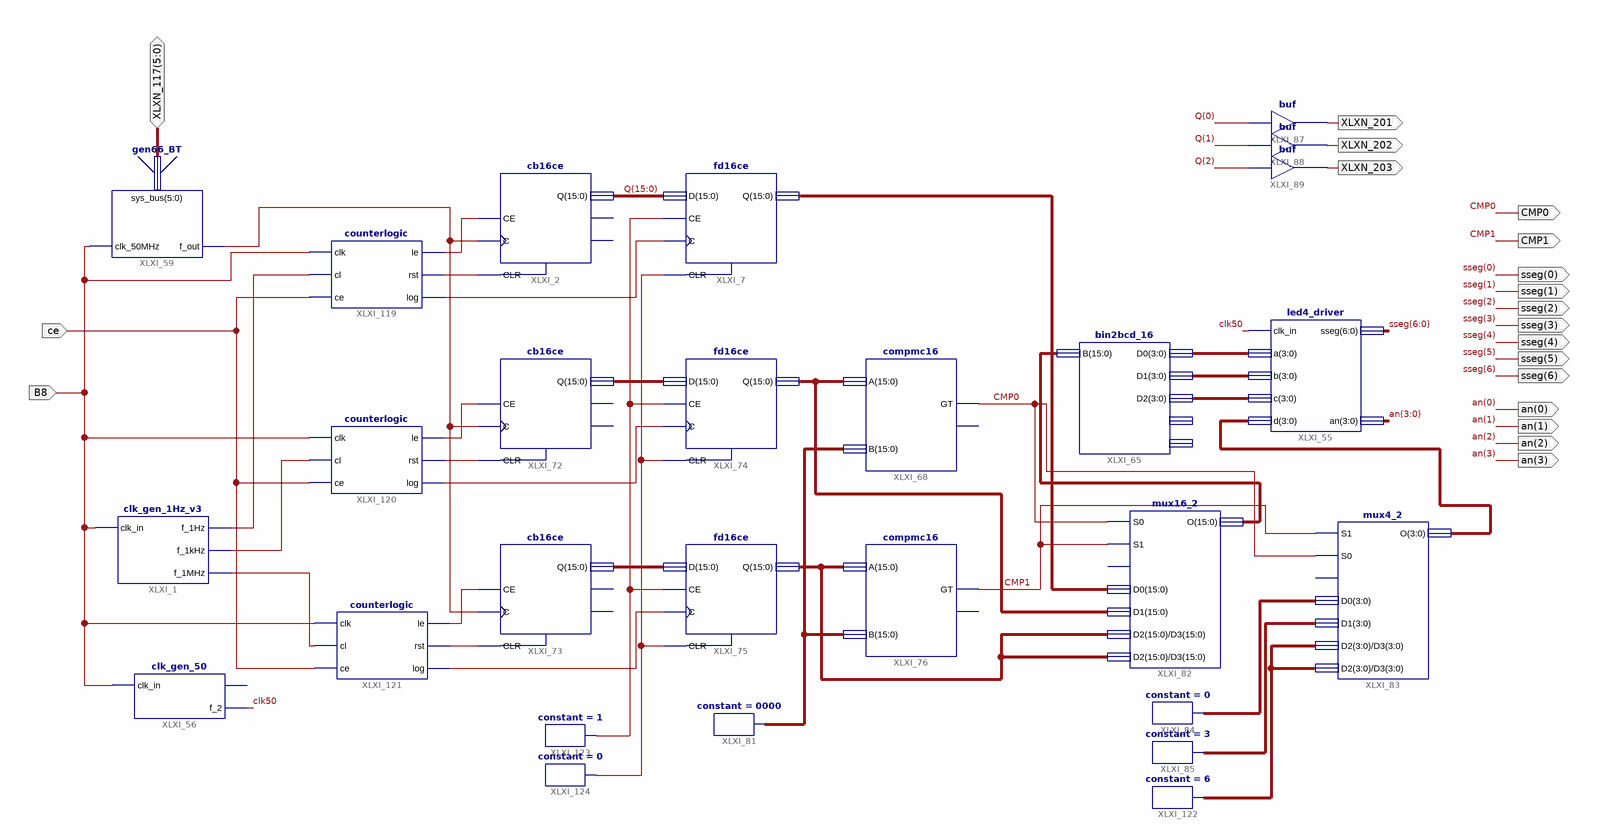
[diagram p0: schematic sheet 1]
// Xilinx ISE schematic czestotliwosci.sch (spartan3e) as structural Verilog: 27 symbols, 19 ports
module czestotliwosci (
  input  B8,
  input  ce,
  inout  [5:0] XLXN_117,
  output [6:0] sseg,
  output [3:0] an,
  output XLXN_201,
  output XLXN_202,
  output XLXN_203,
  output CMP0,
  output CMP1
);

  wire clk50, XLXN_258, XLXN_259, XLXN_264, XLXN_265, XLXN_266, XLXN_268, XLXN_269, XLXN_270, XLXN_272,
       XLXN_273, XLXN_274, XLXN_277, XLXN_279, XLXN_280, XLXN_281;
  wire [3:0] XLXN_98, XLXN_99, XLXN_132, XLXN_193, XLXN_194, XLXN_196, XLXN_254;
  wire [15:0] Q, XLXN_154, XLXN_157, XLXN_244, XLXN_284, XLXN_286, XLXN_287, XLXN_290;

  cb16ce XLXI_2 (.C(XLXN_277), .CE(XLXN_274), .CLR(XLXN_273), .Q(Q));  // open: CEO, TC
  fd16ce XLXI_7 (.C(XLXN_272), .CE(XLXN_259), .CLR(XLXN_264), .D(Q), .Q(XLXN_290));
  led4_driver XLXI_55 (.clk_in(clk50), .a(XLXN_132), .b(XLXN_98), .c(XLXN_99), .d(XLXN_193), .sseg(sseg), .an(an));
  clk_gen_50 XLXI_56 (.clk_in(B8), .f_2(clk50));  // open: f_1
  gen66_BT #(.pmodName("JC")) XLXI_59 (.clk_50MHz(B8), .sys_bus(XLXN_117), .f_out(XLXN_277));
  bin2bcd_16 XLXI_65 (.B(XLXN_244), .D2(XLXN_99), .D1(XLXN_98), .D0(XLXN_132));  // open: D3, D4
  compmc16 XLXI_68 (.A(XLXN_287), .B(XLXN_284), .GT(CMP0));  // open: LT
  cb16ce XLXI_72 (.C(XLXN_277), .CE(XLXN_270), .CLR(XLXN_269), .Q(XLXN_154));  // open: CEO, TC
  cb16ce XLXI_73 (.C(XLXN_277), .CE(XLXN_266), .CLR(XLXN_265), .Q(XLXN_157));  // open: CEO, TC
  fd16ce XLXI_74 (.C(XLXN_268), .CE(XLXN_259), .CLR(XLXN_264), .D(XLXN_154), .Q(XLXN_287));
  fd16ce XLXI_75 (.C(XLXN_258), .CE(XLXN_259), .CLR(XLXN_264), .D(XLXN_157), .Q(XLXN_286));
  compmc16 XLXI_76 (.A(XLXN_286), .B(XLXN_284), .GT(CMP1));  // open: LT
  constant #(.CValue("0000")) XLXI_81 (.O(XLXN_284));
  mux16_2 XLXI_82 (
    .D0(XLXN_290), .D1(XLXN_287), .D2(XLXN_286), .D3(XLXN_286), .O(XLXN_244), .S1(CMP1), .S0(CMP0));  // open: E
  mux4_2 XLXI_83 (
    .S1(CMP1), .S0(CMP0), .D0(XLXN_194), .D1(XLXN_254), .D2(XLXN_196), .D3(XLXN_196), .O(XLXN_193));  // open: E
  constant #(.CValue("0")) XLXI_84 (.O(XLXN_194));
  buf XLXI_87 (XLXN_201, Q[0]);
  buf XLXI_88 (XLXN_202, Q[1]);
  buf XLXI_89 (XLXN_203, Q[2]);
  clk_gen_1Hz_v3 XLXI_1 (.clk_in(B8), .f_1Hz(XLXN_279), .f_1kHz(XLXN_280), .f_1MHz(XLXN_281));
  constant #(.CValue("3")) XLXI_85 (.O(XLXN_254));
  counterlogic XLXI_119 (.clk(B8), .cl(XLXN_279), .ce(ce), .le(XLXN_274), .rst(XLXN_273), .log(XLXN_272));
  counterlogic XLXI_120 (.clk(B8), .cl(XLXN_280), .ce(ce), .le(XLXN_270), .rst(XLXN_269), .log(XLXN_268));
  counterlogic XLXI_121 (.clk(B8), .cl(XLXN_281), .ce(ce), .le(XLXN_266), .rst(XLXN_265), .log(XLXN_258));
  constant #(.CValue("6")) XLXI_122 (.O(XLXN_196));
  constant #(.CValue("1")) XLXI_123 (.O(XLXN_259));
  constant #(.CValue("0")) XLXI_124 (.O(XLXN_264));

  // Notes on the sheet:
  //   LOC on signal sseg(0) = L18
  //   LOC on signal sseg(1) = F18
  //   LOC on signal sseg(2) = D17
  //   LOC on signal sseg(3) = D16
  //   LOC on signal sseg(4) = G14
  //   LOC on signal sseg(5) = J17
  //   LOC on signal sseg(6) = H14
  //   LOC on signal an(0) = F17
  //   LOC on signal an(1) = H17
  //   LOC on signal an(2) = C18
  //   LOC on signal an(3) = F15
  //   LOC on signal XLXN_201 = K15
  //   LOC on signal XLXN_202 = K14
  //   LOC on signal XLXN_203 = E17
  //   LOC on signal B8 = B8
  //   LOC on signal ce = G18
  //   LOC on signal CMP0 = J14
  //   LOC on signal CMP1 = J15
endmodule
